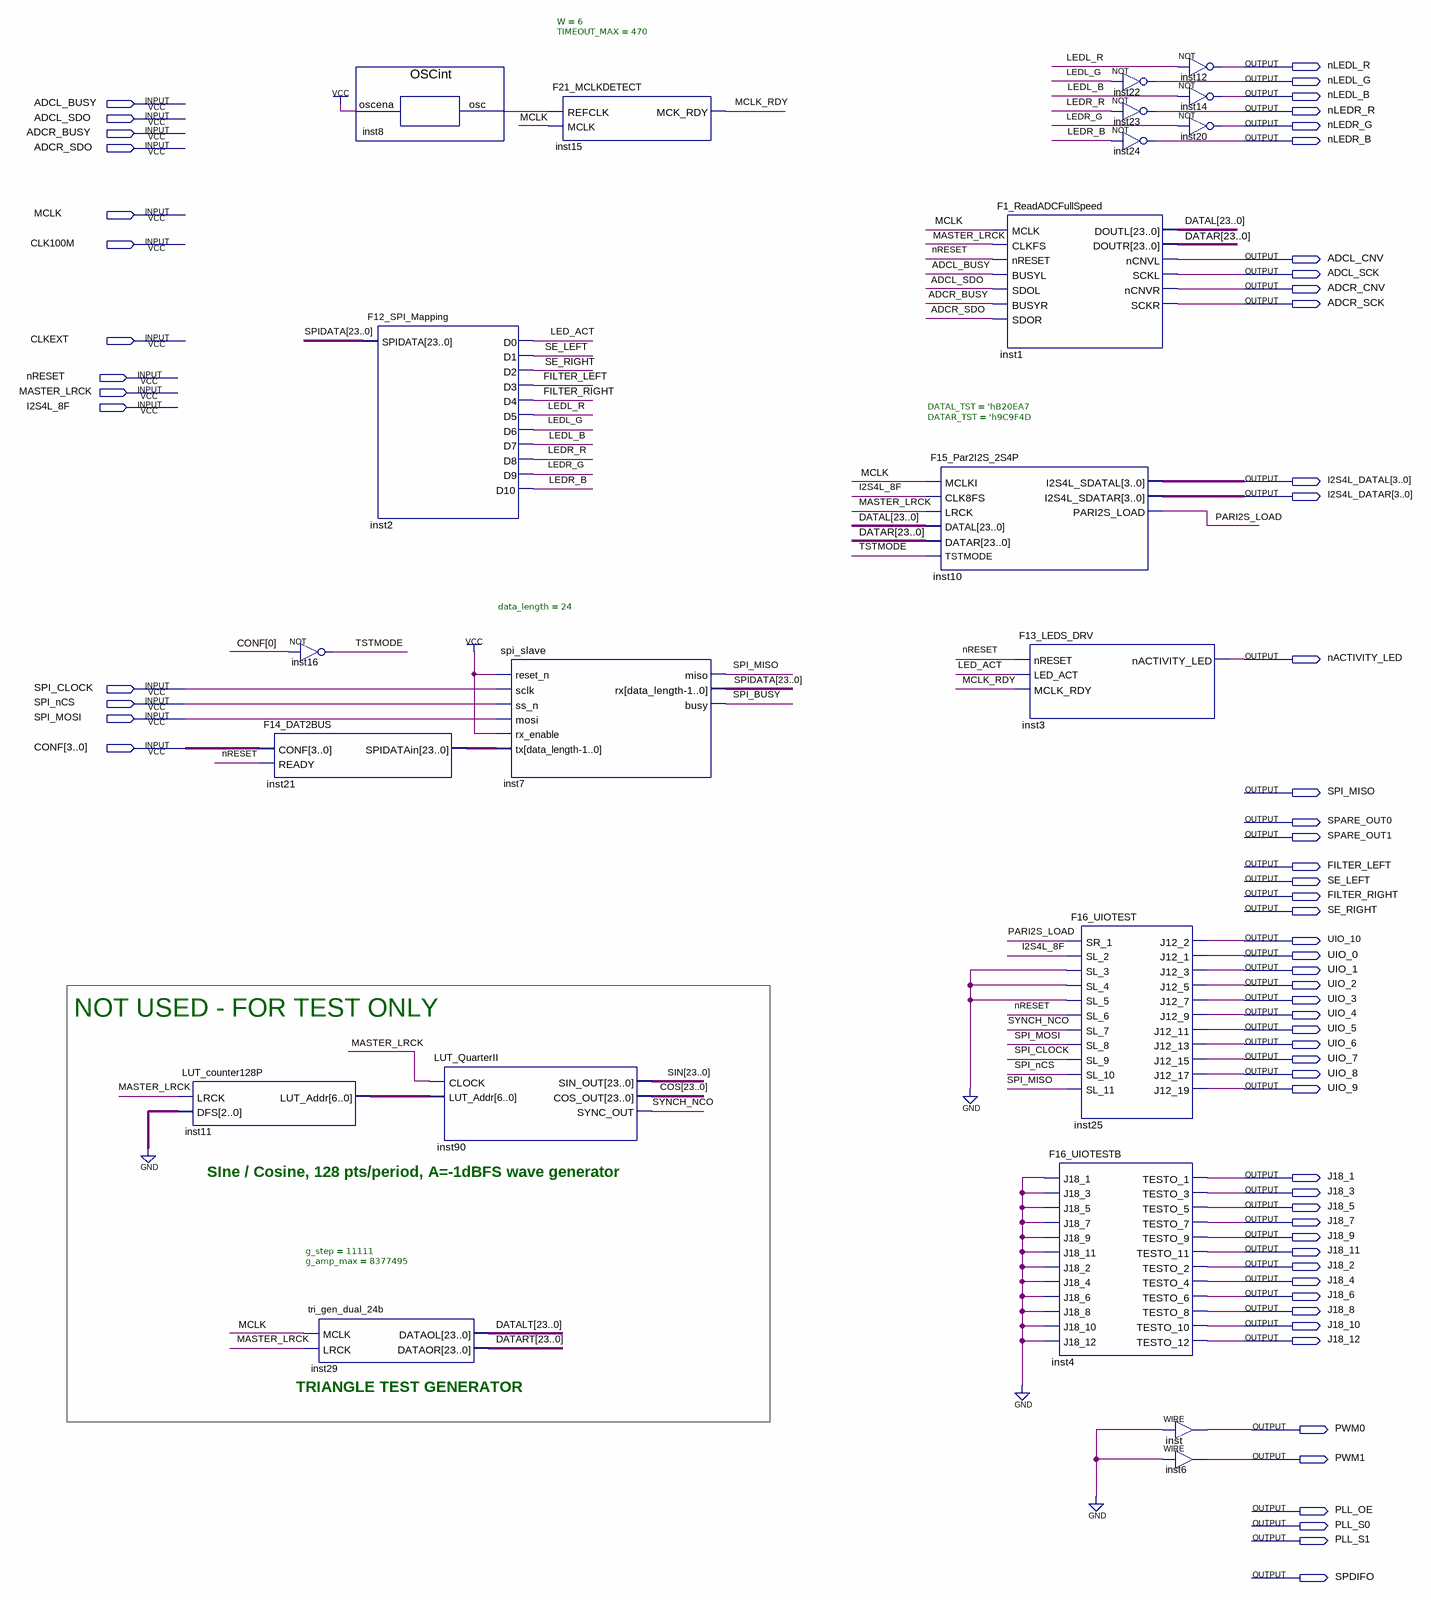
[diagram p0: schematic sheet]
// Quartus schematic AA2380_MAXV.bdf as structural Verilog: 22 symbols, 63 pins
module AA2380_MAXV (
  input  ADCL_BUSY,
  input  ADCL_SDO,
  input  ADCR_BUSY,
  input  ADCR_SDO,
  input  MCLK,
  input  CLK100M,
  input  CLKEXT,
  input  nRESET,
  input  MASTER_LRCK,
  input  I2S4L_8F,
  input  SPI_CLOCK,
  input  SPI_nCS,
  input  SPI_MOSI,
  input  [3:0] CONF,
  output nLEDL_R,
  output nLEDL_G,
  output nLEDL_B,
  output nLEDR_R,
  output nLEDR_G,
  output nLEDR_B,
  output ADCL_CNV,
  output ADCL_SCK,
  output ADCR_CNV,
  output ADCR_SCK,
  output [3:0] I2S4L_DATAL,
  output [3:0] I2S4L_DATAR,
  output nACTIVITY_LED,
  output SPI_MISO,
  output SPARE_OUT0,
  output SPARE_OUT1,
  output FILTER_LEFT,
  output SE_LEFT,
  output FILTER_RIGHT,
  output SE_RIGHT,
  output UIO_10,
  output UIO_0,
  output UIO_1,
  output UIO_2,
  output UIO_3,
  output UIO_4,
  output UIO_5,
  output UIO_6,
  output UIO_7,
  output UIO_8,
  output UIO_9,
  output J18_1,
  output J18_3,
  output J18_5,
  output J18_7,
  output J18_9,
  output J18_11,
  output J18_2,
  output J18_4,
  output J18_6,
  output J18_8,
  output J18_10,
  output J18_12,
  output PWM0,
  output PWM1,
  output PLL_OE,
  output PLL_S0,
  output PLL_S1,
  output SPDIFO
);

  wire inst8_osc, LED_ACT, LEDL_B, LEDL_G, LEDL_R, LEDR_B, LEDR_G, LEDR_R, MCLK_RDY, PARI2S_LOAD, SPI_BUSY,
       SYNCH_NCO, TSTMODE;
  wire [6:0] inst11_lut_addr;
  wire [23:0] COS, DATAL, DATALT, DATAR, DATART, inst21_spidatain, SIN, SPIDATA;

  LUT_counter128P inst11 (.LRCK(MASTER_LRCK), .DFS(3'b000), .LUT_Addr(inst11_lut_addr));
  F14_DAT2BUS inst21 (.CONF(CONF), .READY(nRESET), .SPIDATAin(inst21_spidatain));
  not inst16 (TSTMODE, CONF[0]);
  tri_gen_dual_24b #(.g_step(11111), .g_amp_max(8377495)) inst29 (
    .MCLK(MCLK), .LRCK(MASTER_LRCK), .DATAOL(DATALT), .DATAOR(DATART));
  OSCint inst8 (.oscena(1'b1), .osc(inst8_osc));
  F12_SPI_Mapping inst2 (
    .SPIDATA(SPIDATA), .D0(LED_ACT), .D1(SE_LEFT), .D2(SE_RIGHT), .D3(FILTER_LEFT), .D4(FILTER_RIGHT),
    .D5(LEDL_R), .D6(LEDL_G), .D7(LEDL_B), .D8(LEDR_R), .D9(LEDR_G), .D10(LEDR_B));
  LUT_QuarterII inst90 (
    .CLOCK(MASTER_LRCK), .LUT_Addr(inst11_lut_addr), .SIN_OUT(SIN), .COS_OUT(COS), .SYNC_OUT(SYNCH_NCO));
  spi_slave #(.data_length(24)) inst7 (
    .reset_n(1'b1), .sclk(SPI_CLOCK), .ss_n(SPI_nCS), .mosi(SPI_MOSI), .rx_enable(1'b1),
    .tx(inst21_spidatain), .miso(SPI_MISO), .rx(SPIDATA), .busy(SPI_BUSY));
  F21_MCLKDETECT #(.W(6), .TIMEOUT_MAX(470)) inst15 (.REFCLK(inst8_osc), .MCLK(MCLK), .MCK_RDY(MCLK_RDY));
  F15_Par2I2S_2S4P #(.DATAL_TST('hB20EA7), .DATAR_TST('h9C9F4D)) inst10 (
    .MCLKI(MCLK), .CLK8FS(I2S4L_8F), .LRCK(MASTER_LRCK), .DATAL(DATAL), .DATAR(DATAR), .TSTMODE(TSTMODE),
    .I2S4L_SDATAL(I2S4L_DATAL), .I2S4L_SDATAR(I2S4L_DATAR), .PARI2S_LOAD(PARI2S_LOAD));
  F1_ReadADCFullSpeed inst1 (
    .MCLK(MCLK), .CLKFS(MASTER_LRCK), .nRESET(nRESET), .BUSYL(ADCL_BUSY), .SDOL(ADCL_SDO), .BUSYR(ADCR_BUSY),
    .SDOR(ADCR_SDO), .DOUTL(DATAL), .DOUTR(DATAR), .nCNVL(ADCL_CNV), .SCKL(ADCL_SCK), .nCNVR(ADCR_CNV),
    .SCKR(ADCR_SCK));
  F13_LEDS_DRV inst3 (.nRESET(nRESET), .LED_ACT(LED_ACT), .MCLK_RDY(MCLK_RDY), .nACTIVITY_LED(nACTIVITY_LED));
  F16_UIOTESTB inst4 (
    .J18_1(1'b0), .J18_3(1'b0), .J18_5(1'b0), .J18_7(1'b0), .J18_9(1'b0), .J18_11(1'b0), .J18_2(1'b0),
    .J18_4(1'b0), .J18_6(1'b0), .J18_8(1'b0), .J18_10(1'b0), .J18_12(1'b0), .TESTO_1(J18_1), .TESTO_3(J18_3),
    .TESTO_5(J18_5), .TESTO_7(J18_7), .TESTO_9(J18_9), .TESTO_11(J18_11), .TESTO_2(J18_2), .TESTO_4(J18_4),
    .TESTO_6(J18_6), .TESTO_8(J18_8), .TESTO_10(J18_10), .TESTO_12(J18_12));
  not inst22 (nLEDL_G, LEDL_G);
  not inst23 (nLEDR_R, LEDR_R);
  not inst24 (nLEDR_B, LEDR_B);
  F16_UIOTEST inst25 (
    .SR_1(PARI2S_LOAD), .SL_2(I2S4L_8F), .SL_3(1'b0), .SL_4(1'b0), .SL_5(1'b0), .SL_6(nRESET),
    .SL_7(SYNCH_NCO), .SL_8(SPI_MOSI), .SL_9(SPI_CLOCK), .SL_10(SPI_nCS), .SL_11(SPI_MISO), .J12_2(UIO_10),
    .J12_1(UIO_0), .J12_3(UIO_1), .J12_5(UIO_2), .J12_7(UIO_3), .J12_9(UIO_4), .J12_11(UIO_5),
    .J12_13(UIO_6), .J12_15(UIO_7), .J12_17(UIO_8), .J12_19(UIO_9));
  assign PWM0 = 1'b0;  // WIRE inst
  assign PWM1 = 1'b0;  // WIRE inst6
  not inst12 (nLEDL_R, LEDL_R);
  not inst14 (nLEDL_B, LEDL_B);
  not inst20 (nLEDR_G, LEDR_G);

  // Notes on the sheet:
  //   NOT USED - FOR TEST ONLY
  //   SIne / Cosine, 128 pts/period, A=-1dBFS wave generator
  //   TRIANGLE TEST GENERATOR
endmodule
